# EAGLE schematic transmitter (EAGLE 6.3)
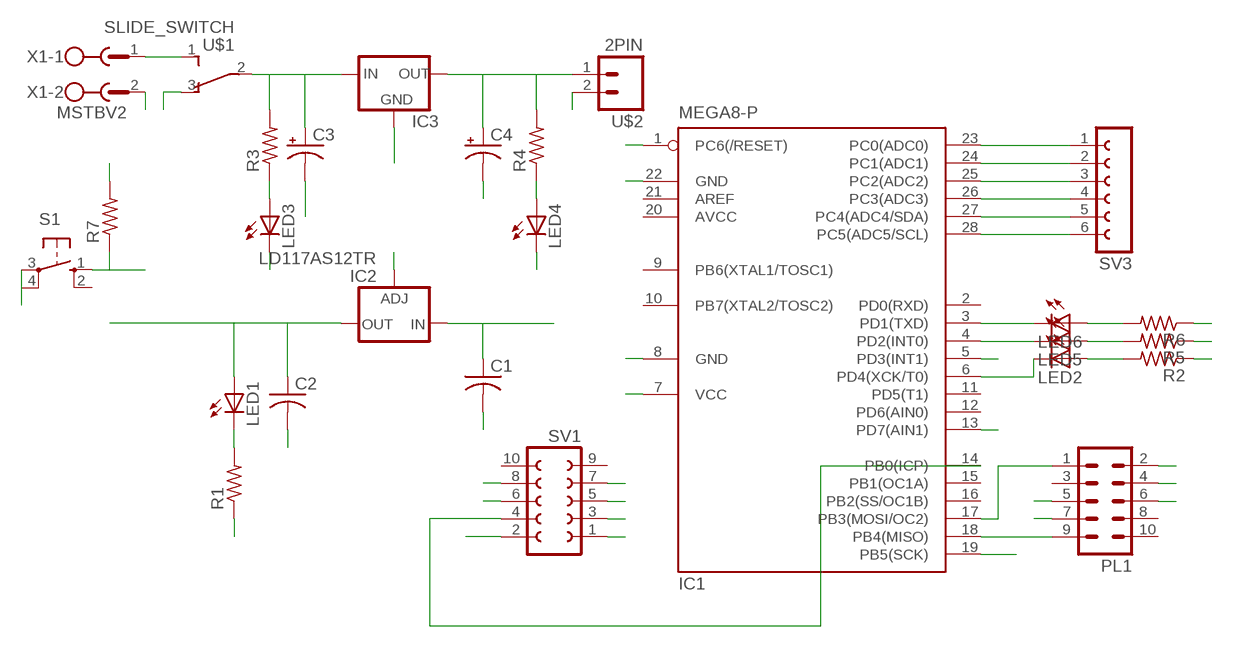
[diagram p0: schematic, sheet 1]

## Parts
C1  C-US025-025X050  [C025-025X050]
C2  C-US025-025X050  [C025-025X050]
C3  CPOL-USE2.5-6  [E2,5-6]
C4  CPOL-USE2.5-6  [E2,5-6]
IC1  MEGA8-P  [DIL28-3]
IC2  LD117AS12TR  [SOT223]
IC3  78XXS  [78XXS]
LED1  LED3MM  [LED3MM]
LED2  LED3MM  [LED3MM]
LED3  LED3MM  [LED3MM]
LED4  LED3MM  [LED3MM]
LED5  LED3MM  [LED3MM]
LED6  LED3MM  [LED3MM]
PL1  ML10  [ML10]
R1  R-US_0207/10  [0207/10]
R2  R-US_0207/10  [0207/10]
R3  R-US_0207/10  [0207/10]
R4  R-US_0207/10  [0207/10]
R5  R-US_0207/10  [0207/10]
R6  R-US_0207/10  [0207/10]
R7  R-US_0207/10  [0207/10]
S1  10-XX  [B3F-10XX]
SV1  FE05-2  [FE05-2]
SV3  FE06-1  [FE06]
U$1  SLIDE_SWITCH  [SPDT]
U$2  2PIN  [2PIN]
X1  MSTBV2  [MSTBV2]

## Nets
CE: IC1.13(PD7(AIN1)) SV1.3
GND: C1.2 C2.2 C3.- C4.- IC1.8(GND) IC1.22(GND) IC2.1(ADJ) IC3.GND LED3.K(C) LED4.K(C) PL1.4 PL1.6 R1.1 S1.3(P) SV1.1 U$1.3(NC) U$2.2 X1.2
IRQ: IC1.5(PD3(INT1)) SV1.8
MISO: IC1.18(PB4(MISO)) PL1.9 SV1.7
MOSI: IC1.17(PB3(MOSI/OC2)) PL1.1 SV1.6
N$1: IC1.23(PC0(ADC0)) SV3.1
N$2: LED5.A R5.2
N$3: LED6.A R6.2
N$4: IC1.24(PC1(ADC1)) SV3.2
N$5: IC1.25(PC2(ADC2)) SV3.3
N$6: IC1.26(PC3(ADC3)) SV3.4
N$7: IC1.27(PC4(ADC4/SDA)) SV3.5
N$8: IC1.28(PC5(ADC5/SCL)) SV3.6
N$9: LED1.K(C) R1.2
N$10: LED2.A R2.2
N$11: C3.+ IC3.IN R3.2 U$1.2(P)
N$12: U$1.1(NO) X1.1
N$13: IC1.14(PB0(ICP)) SV1.4
N$14: LED3.A R3.1
N$15: IC1.6(PD4(XCK/T0)) LED2.K(C)
N$16: LED4.A R4.1
N$17: IC1.4(PD2(INT0)) LED5.K(C)
N$18: IC1.3(PD1(TXD)) LED6.K(C)
RST: IC1.1(PC6(/RESET)) PL1.5 R7.1 S1.1(S)
SCK: IC1.19(PB5(SCK)) PL1.7 SV1.5
VCC: C1.1 C4.+ IC1.7(VCC) IC2.3(IN) IC3.OUT PL1.2 R2.1 R4.2 R7.2 U$2.1
VCC1: R5.1
VCC2: R6.1
VCC3.3: C2.1 IC2.4(OUT) LED1.A SV1.2
Unconnected: IC1.2(PD0(RXD)) IC1.9(PB6(XTAL1/TOSC1)) IC1.10(PB7(XTAL2/TOSC2)) IC1.11(PD5(T1)) IC1.12(PD6(AIN0)) IC1.15(PB1(OC1A)) IC1.16(PB2(SS/OC1B)) IC1.21(AREF) PL1.3 PL1.8 PL1.10 S1.2(S1) S1.4(P1) SV1.9 SV1.10

## Power pins joined to a net without a drawn wire
AVCC: IC1.20(AVCC)

## Library data of the parts
C1 C2 = rcl:C-US: CAPACITOR, American symbol
C3 C4 = rcl:CPOL-US: POLARIZED CAPACITOR, American symbol
IC1 = atmel:MEGA8-P: MICROCONTROLLER 8 Kbytes FLASH, 1 kbytes SRAM, 512 bytes EEPROM, USART, 4-channel 10 bit ADC, 2-channel 8 bit ADC Pin compatible with Atmega48, ATMega88, ATMega168 Source: avr.lbr; OC_FARNELL: unknown; OC_NEWARK: unknown
IC2 = v-reg:LD117A?*: Low drop fixed and adjustable positive voltage regulators 1 A Source: http://www.st.com/stonline/products/literature/ds/7194/ld1117axx.pdf
IC3 = v-reg:78XXS: VOLTAGE REGULATOR
LED1-LED6 = adafruit:LED: LED OSRAM: - CHIPLED LG R971, LG N971, LY N971, LG Q971, LY Q971, LO R971, LY R971 LH N974, LH R974 LS Q976, LO Q976, LY Q976 LO Q996 - Hyper CHIPLED LW Q18S LB Q993, LB Q99A, LB R99A - SideLED LS A670, LO A670, LY A670, LG A670, LP A670 LB A673, LV A673, LT A673, LW A673 LH A674 LY A675 LS A676, LA A676, LO A676, LY A676, LW A676 LS A679, LY A679, LG A679 - Hyper Micro SIDELED® LS Y876, LA Y876, LO Y876, LY Y876 LT Y87S - SmartLED LW L88C, LW L88S LB L89C, LB L89S, LG L890 LS L89K, LO L89K, LY L89K LS L896, LA L896, LO L896, LY L896 - TOPLED LS T670, LO T670, LY T670, LG T670, LP T670 LSG T670, LSP T670, LSY T670, LOP T670, LYG T670 LG T671, LOG T671, LSG T671 LB T673, LV T673, LT T673, LW T673 LH T674 LS T676, LA T676, LO T676, LY T676, LB T676, LH T676, LSB T676, LW T676 LB T67C, LV T67C, LT T67C, LS T67K, LO T67K, LY T67K, LW E67C LS E67B, LA E67B, LO E67B, LY E67B, LB E67C, LV E67C, LT E67C LW T67C LS T679, LY T679, LG T679 LS T770, LO T770, LY T770, LG T770, LP T770 LB T773, LV T773, LT T773, LW T773 LH T774 LS E675, LA E675, LY E675, LS T675 LS T776, LA T776, LO T776, LY T776, LB T776 LHGB T686 LT T68C, LB T68C - Hyper Mini TOPLED® LB M676 - Mini TOPLED Santana® LG M470 LS M47K, LO M47K, LY M47K Source: http://www.osram.convergy.de/
PL1 = con-harting-ml:ML10: HARTING; OC_FARNELL: unknown; OC_NEWARK: unknown
R1-R7 = rcl:R-US_: RESISTOR, American symbol
S1 = switch-omron:10-XX: OMRON SWITCH; MPN: B3F-1000; OC_FARNELL: 176432; OC_NEWARK: 36M3542
SV1 = con-lsta:FE05-2: FEMALE HEADER; OC_FARNELL: unknown; OC_NEWARK: unknown
SV3 = con-lsta:FE06-1: FEMALE HEADER; OC_FARNELL: unknown; OC_NEWARK: unknown
U$1 = RSC:SLIDE_SWITCH
U$2 = RSC:2PIN: 2 Pin Black Relimate
X1 = con-phoenix-508:MSTBV2: PHOENIX; MPN: MSTBV 2,5/2-GF-5.08; OC_FARNELL: 1792792; OC_NEWARK: 69R9845